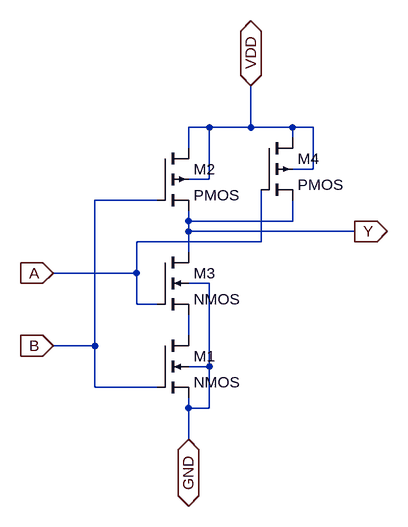
[diagram p0: schematic NAND.asc]
NAND.asc, the LTspice schematic file:
Version 4
SHEET 1 880 680
WIRE 256 -112 224 -112
WIRE 320 -112 320 -176
WIRE 320 -112 256 -112
WIRE 384 -112 320 -112
WIRE 416 -112 384 -112
WIRE 384 -96 384 -112
WIRE 224 -80 224 -112
WIRE 416 -48 416 -112
WIRE 416 -48 384 -48
WIRE 256 -32 256 -112
WIRE 256 -32 224 -32
WIRE 176 0 80 0
WIRE 224 32 224 16
WIRE 384 32 384 0
WIRE 384 32 224 32
WIRE 224 48 224 32
WIRE 480 48 224 48
WIRE 336 64 336 -16
WIRE 336 64 144 64
WIRE 224 80 224 48
WIRE 144 112 144 64
WIRE 144 112 16 112
WIRE 256 128 224 128
WIRE 144 160 144 112
WIRE 176 160 144 160
WIRE 224 208 224 176
WIRE 80 224 80 0
WIRE 80 224 16 224
WIRE 256 256 256 128
WIRE 256 256 224 256
WIRE 80 288 80 224
WIRE 176 288 80 288
WIRE 224 320 224 304
WIRE 256 320 256 256
WIRE 256 320 224 320
WIRE 224 368 224 320
FLAG 224 368 GND
IOPIN 224 368 BiDir
FLAG 16 112 A
IOPIN 16 112 In
FLAG 16 224 B
IOPIN 16 224 In
FLAG 320 -176 VDD
IOPIN 320 -176 BiDir
FLAG 480 48 Y
IOPIN 480 48 Out
SYMBOL nmos4 176 208 R0
SYMATTR InstName M1
SYMATTR Value2 l=180n w=150n
SYMBOL pmos4 176 -80 R0
SYMATTR InstName M2
SYMATTR Value2 l=180n w=300n
SYMBOL nmos4 176 80 R0
SYMATTR InstName M3
SYMATTR Value2 l=180n w=150n
SYMBOL pmos4 336 -96 R0
SYMATTR InstName M4
SYMATTR Value2 l=180n w=300n

The netlist it stands for:
* NAND.asc
M1 N001 B GND GND NMOS l=180n w=150n
M2 VDD B Y VDD PMOS l=180n w=300n
M3 Y A N001 GND NMOS l=180n w=150n
M4 VDD A Y VDD PMOS l=180n w=300n
.model NMOS NMOS
.model PMOS PMOS
.lib standard.mos
.backanno
.end